# Altium project AuxPowerSupply.PrjPcb (part 1 of 3)
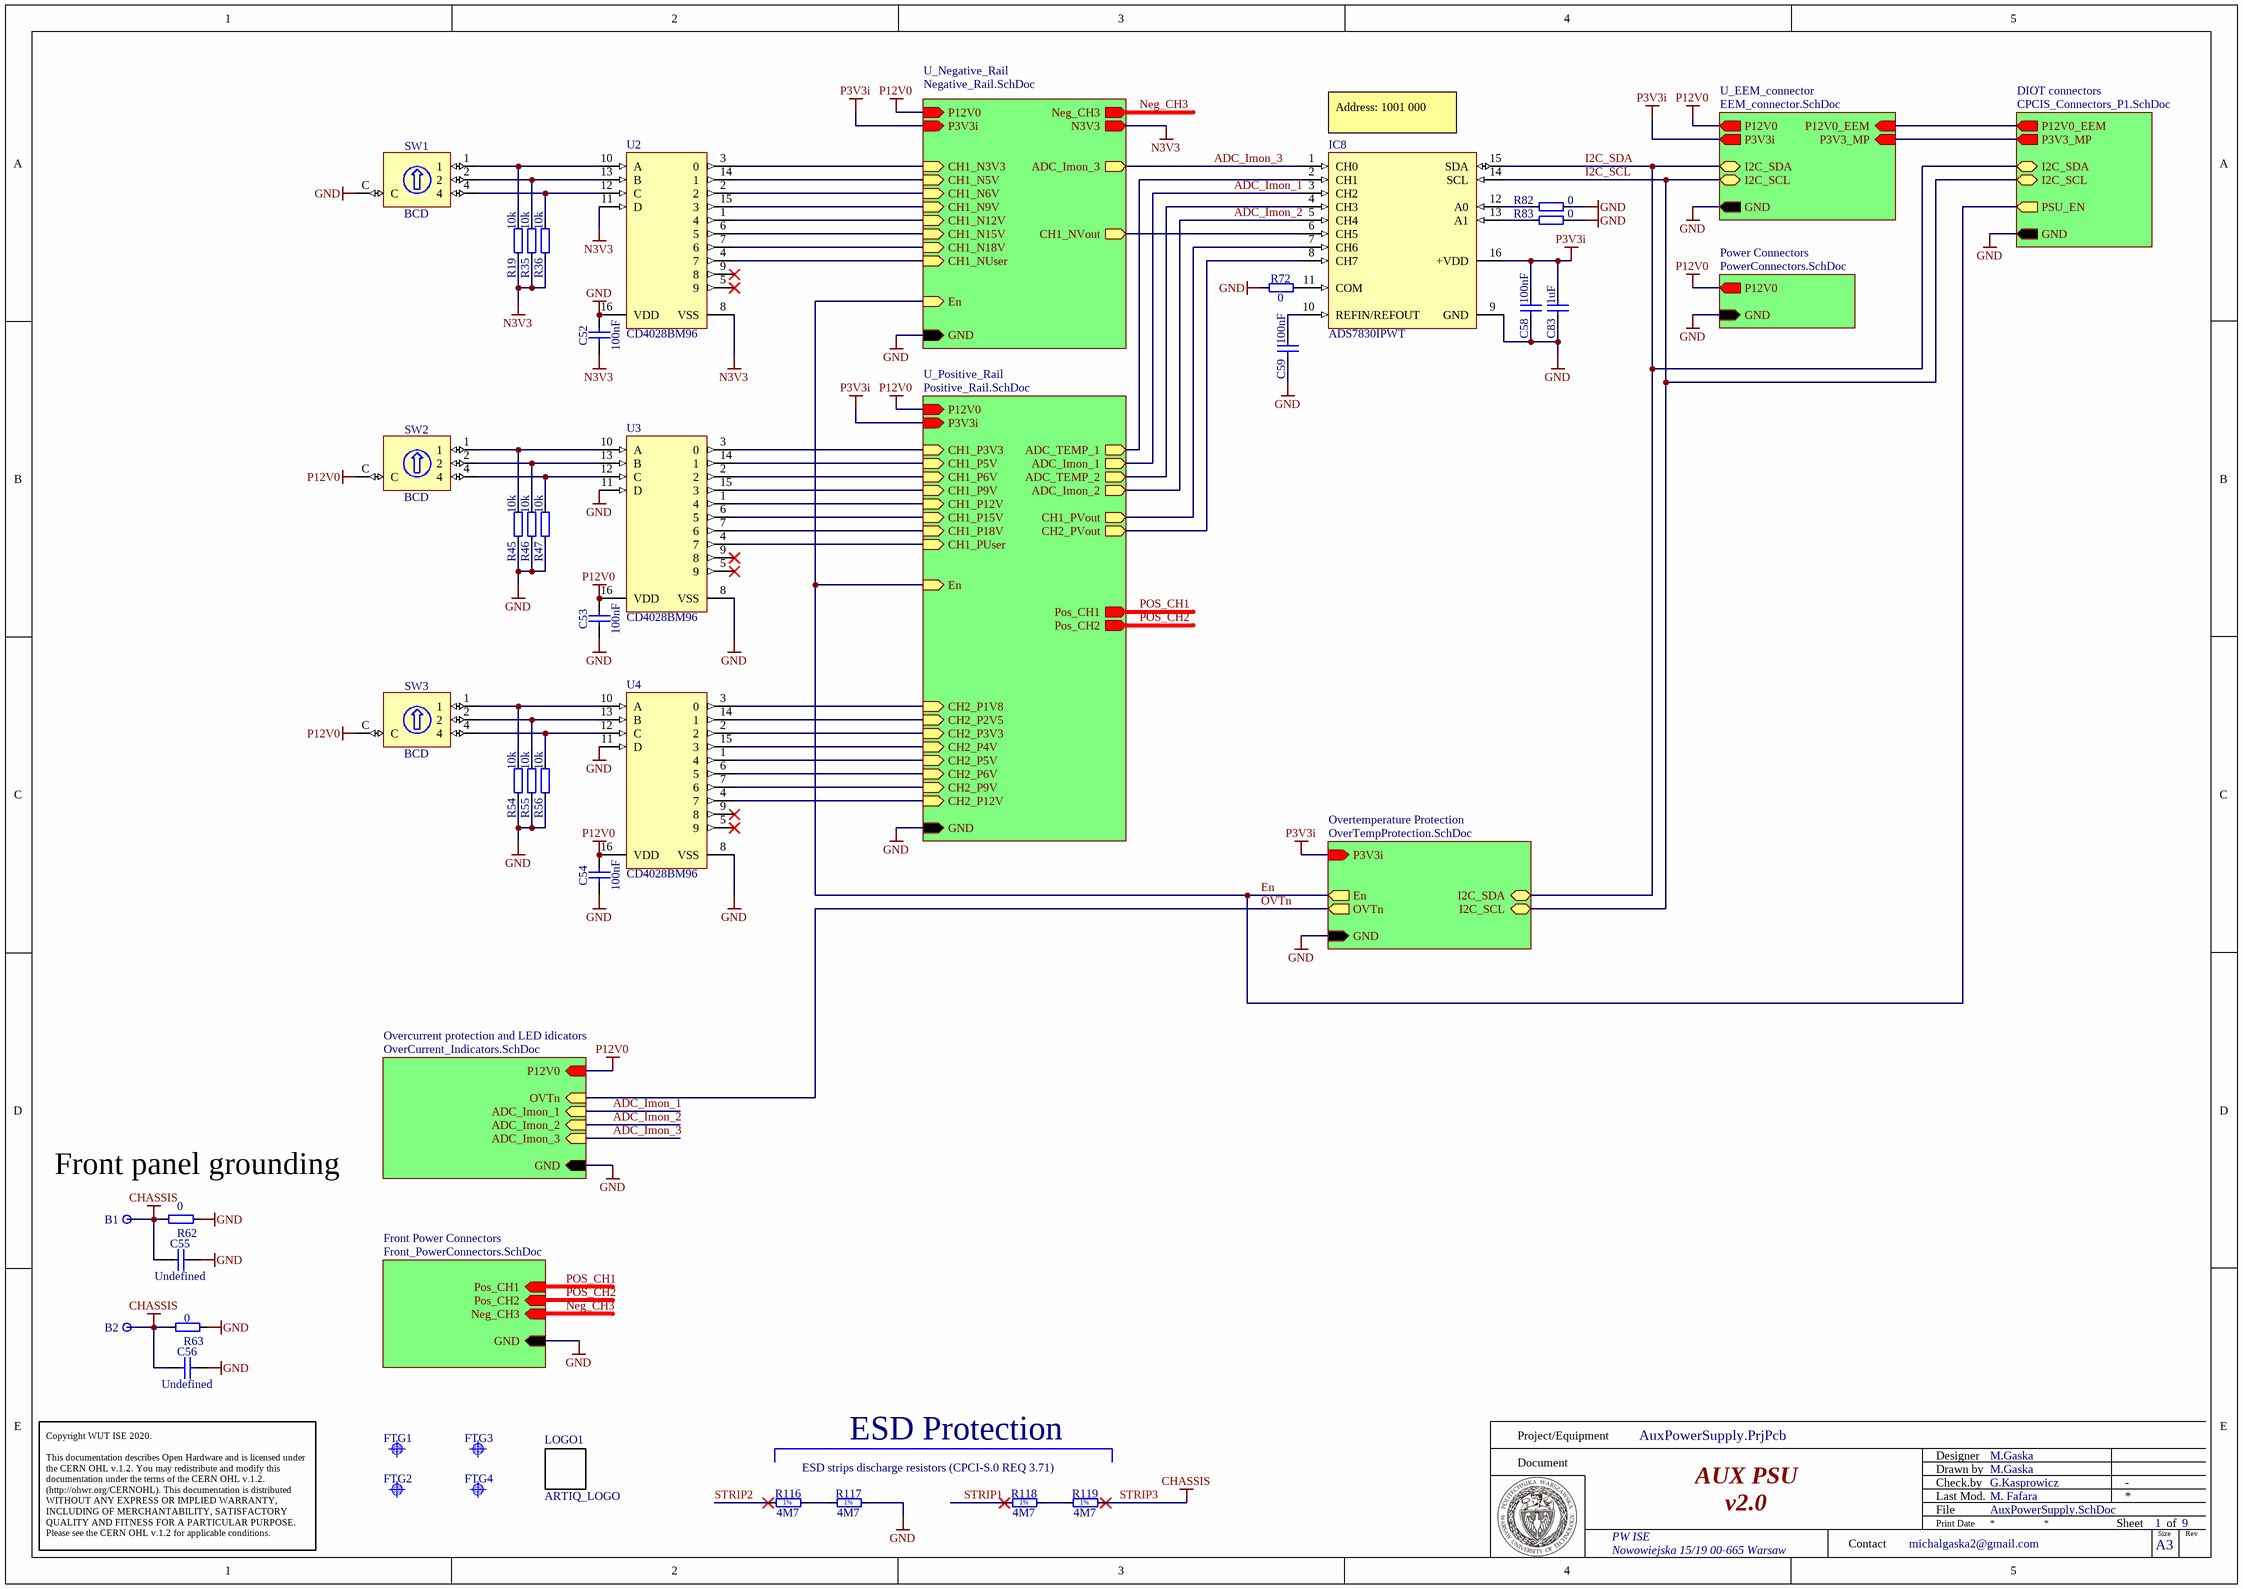
[diagram p0: AuxPowerSupply.SchDoc]
P_version: 2.0
9 sheets, 347 parts. Net scope: strictly hierarchical (ports join the sheet entries above them; power ports are local).
Board file: AuxPowerSupply.PcbDoc
Sheets:
  AuxPowerSupply.SchDoc
    U_Negative_Rail = Negative_Rail.SchDoc
    U_Positive_Rail = Positive_Rail.SchDoc
    U_EEM_connector = EEM_connector.SchDoc
    Power Connectors = PowerConnectors.SchDoc
    Overcurrent protection and LED idicators = OverCurrent_Indicators.SchDoc
    Front Power Connectors = Front_PowerConnectors.SchDoc
    Overtemperature Protection = OverTempProtection.SchDoc
    DIOT connectors = CPCIS_Connectors_P1.SchDoc

## Sheet AuxPowerSupply.SchDoc: AUX PSU
size 420 x 297 mm; CheckedBy: G.Kasprowicz; DrawnBy: M.Gaska; Address1: PW ISE; Address2: Nowowiejska 15/19 00-665 Warsaw; Address3: michalgaska2@gmail.com; DocumentNumber: 1; Revision: 2.0; SheetNumber: 1; SheetTotal: 9; EDA_Number: ARTIQ; Projet: AUX PSU; ModifiedBy: M. Fafara; CheckedDate: -; Title2: v2.0; DivGrp: WUT ISE; Designer: M.Gaska

### Parts
B1  (no value)  [MTG270_500]  (no BOM)
B2  (no value)  [MTG270_500]  (no BOM)
C52  100nF  [CAPC1608X87N]
C53  100nF  [CAPC1608X87N]
C54  100nF  [CAPC1608X87N]
C55  Undefined  [CAPC2012X135N]
C56  Undefined  [CAPC2012X135N]
C58  100nF  [CAPC1608X87N]
C59  100nF  [CAPC1608X87N]
C83  1uF  [CAPC1608X87N]
FTG1  (no value)  [FIDUCIAL_TOP_C100-200]
FTG2  (no value)  [FIDUCIAL_TOP_S100-200]
FTG3  (no value)  [FIDUCIAL_TOP_S100-200]
FTG4  (no value)  [FIDUCIAL_TOP_S100-200]
IC8  ADS7830IPWT  [SOP65P640X120-16N]
LOGO1  ARTIQ_LOGO  [ARTIQ_Logo]  (no BOM)
R19  10k  [RESC1608X55N]
R35  10k  [RESC1608X55N]
R36  10k  [RESC1608X55N]
R45  10k  [RESC1608X55N]
R46  10k  [RESC1608X55N]
R47  10k  [RESC1608X55N]
R54  10k  [RESC1608X55N]
R55  10k  [RESC1608X55N]
R56  10k  [RESC1608X55N]
R62  0  [RESC1608X55N]
R63  0  [RESC1608X55N]
R72  0  [RESC1608X55N]
R82  0  [RESC1608X55N]
R83  0  [RESC1608X55N]
R116  4M7  [RESC2113X55N]
R117  4M7  [RESC2113X55N]
R118  4M7  [RESC2113X55N]
R119  4M7  [RESC2113X55N]
SW1  BCD  [SW_NIDEC-COPAL-ELECTRONICS_S-81X1]
SW2  BCD  [SW_NIDEC-COPAL-ELECTRONICS_S-81X1]
SW3  BCD  [SW_NIDEC-COPAL-ELECTRONICS_S-81X1]
U2  CD4028BM96  [D0016A_M]
U3  CD4028BM96  [D0016A_M]
U4  CD4028BM96  [D0016A_M]

### Sub-sheets
DIOT connectors = CPCIS_Connectors_P1.SchDoc: I2C_SDA (bidir), I2C_SCL (bidir), GND (out), P12V0_EEM (out), P3V3_MP (out), PSU_EN (out)
Front Power Connectors = Front_PowerConnectors.SchDoc: Pos_CH1 (in), Pos_CH2 (in), Neg_CH3 (in), GND (in)
Overcurrent protection and LED idicators = OverCurrent_Indicators.SchDoc: P12V0 (in), GND (in), OVTn (in), ADC_Imon_3 (in), ADC_Imon_2 (in), ADC_Imon_1 (in)
Overtemperature Protection = OverTempProtection.SchDoc: P3V3i (in), GND (in), I2C_SDA (bidir), I2C_SCL (bidir), En (out), OVTn (out)
Power Connectors = PowerConnectors.SchDoc: GND (in), P12V0 (out)
U_EEM_connector = EEM_connector.SchDoc: I2C_SDA (bidir), I2C_SCL (bidir), P12V0 (out), P3V3i (out), GND (out), P12V0_EEM (in), P3V3_MP (in)
U_Negative_Rail = Negative_Rail.SchDoc: CH1_N18V (in), CH1_N5V (in), CH1_N9V (in), CH1_N12V (in), CH1_N15V (in), ADC_Imon_3 (out), CH1_NVout (out), CH1_N3V3 (in), CH1_NUser (in), CH1_N6V (in), En (in), GND (in), P12V0 (in), P3V3i (in), Neg_CH3 (out), N3V3 (out)
U_Positive_Rail = Positive_Rail.SchDoc: CH2_P6V (in), CH2_P3V3 (in), CH2_P4V (in), CH1_P15V (in), CH1_P9V (in), CH1_P12V (in), CH2_P5V (in), CH1_P5V (in), CH1_P18V (in), ADC_TEMP_2 (out), ADC_Imon_2 (out), ADC_Imon_1 (out), ADC_TEMP_1 (out), CH1_PVout (out), CH2_PVout (out), CH2_P2V5 (in), CH1_P3V3 (in), CH2_P1V8 (in), CH1_PUser (in), CH2_P9V (in), CH1_P6V (in), CH2_P12V (in), En (in), P12V0 (in), GND (in), Pos_CH1 (out), Pos_CH2 (out), P3V3i (in)

### Nets
GND: C52.2 C53.1 C54.1 C55.2 C56.2 C58.1 C59.1 C83.1 IC8.9(GND) R45.1 R46.1 R47.1 R54.1 R55.1 R56.1 R62.1 R63.1 R72.1 R82.2 R83.2 R117.2 SW1.C U2.16(VDD) U3.8(VSS) U3.11(D) U4.8(VSS) U4.11(D) ; sheet U_Negative_Rail/GND, sheet U_Positive_Rail/GND, sheet U_EEM_connector/GND, sheet Power Connectors/GND, sheet Overcurrent protection and LED idicators/GND, sheet Front Power Connectors/GND, sheet Overtemperature Protection/GND, sheet DIOT connectors/GND
N3V3: C52.1 R19.1 R35.1 R36.1 U2.8(VSS) U2.11(D) ; sheet U_Negative_Rail/N3V3
Neg_CH3: sheet U_Negative_Rail/Neg_CH3, sheet Front Power Connectors/Neg_CH3
P3V3_MP: sheet U_EEM_connector/P3V3_MP, sheet DIOT connectors/P3V3_MP
P3V3i: C58.2 C83.2 IC8.16(+VDD) ; sheet U_Negative_Rail/P3V3i, sheet U_Positive_Rail/P3V3i, sheet U_EEM_connector/P3V3i, sheet Overtemperature Protection/P3V3i
P12V0: C53.2 C54.2 SW2.C SW3.C U3.16(VDD) U4.16(VDD) ; sheet U_Negative_Rail/P12V0, sheet U_Positive_Rail/P12V0, sheet U_EEM_connector/P12V0, sheet Power Connectors/P12V0, sheet Overcurrent protection and LED idicators/P12V0
P12V0_EEM: sheet U_EEM_connector/P12V0_EEM, sheet DIOT connectors/P12V0_EEM
POS_CH1: sheet U_Positive_Rail/Pos_CH1, sheet Front Power Connectors/Pos_CH1
POS_CH2: sheet U_Positive_Rail/Pos_CH2, sheet Front Power Connectors/Pos_CH2
STRIP3: B1.1 B2.1 C55.1 C56.1 R62.2 R63.2 R119.2  [also labelled CHASSIS]
ADC_Imon_1: IC8.3(CH2) ; sheet U_Positive_Rail/ADC_Imon_1, sheet Overcurrent protection and LED idicators/ADC_Imon_1
ADC_Imon_2: IC8.5(CH4) ; sheet U_Positive_Rail/ADC_Imon_2, sheet Overcurrent protection and LED idicators/ADC_Imon_2
ADC_Imon_3: IC8.1(CH0) ; sheet U_Negative_Rail/ADC_Imon_3, sheet Overcurrent protection and LED idicators/ADC_Imon_3
CH1_NVout: IC8.6(CH5) ; sheet U_Negative_Rail/CH1_NVout
CH1_PVout: IC8.7(CH6) ; sheet U_Positive_Rail/CH1_PVout
CH2_PVout: IC8.8(CH7) ; sheet U_Positive_Rail/CH2_PVout
En: sheet U_Negative_Rail/En, sheet U_Positive_Rail/En, sheet Overtemperature Protection/En, sheet DIOT connectors/PSU_EN
I2C_SCL: IC8.14(SCL) ; sheet U_EEM_connector/I2C_SCL, sheet Overtemperature Protection/I2C_SCL, sheet DIOT connectors/I2C_SCL
I2C_SDA: IC8.15(SDA) ; sheet U_EEM_connector/I2C_SDA, sheet Overtemperature Protection/I2C_SDA, sheet DIOT connectors/I2C_SDA
OVTn: sheet Overcurrent protection and LED idicators/OVTn, sheet Overtemperature Protection/OVTn
STRIP1: R118.1
STRIP2: R116.1
NetC59_2: C59.2 IC8.10(REFIN/REFOUT)
NetC72_2: IC8.2(CH1) ; sheet U_Positive_Rail/ADC_TEMP_1
NetC75_2: IC8.4(CH3) ; sheet U_Positive_Rail/ADC_TEMP_2
NetIC8_11: IC8.11(COM) R72.2
NetIC8_12: IC8.12(A0) R82.1
NetIC8_13: IC8.13(A1) R83.1
NetIC12_1: U2.7(6) ; sheet U_Negative_Rail/CH1_N18V
NetIC12_3: U2.6(5) ; sheet U_Negative_Rail/CH1_N15V
NetIC12_5: U2.4(7) ; sheet U_Negative_Rail/CH1_NUser
NetIC12_9: U2.1(4) ; sheet U_Negative_Rail/CH1_N12V
NetIC12_11: U2.2 ; sheet U_Negative_Rail/CH1_N6V
NetIC12_13: U2.15(3) ; sheet U_Negative_Rail/CH1_N9V
NetIC13_1: U2.14(1) ; sheet U_Negative_Rail/CH1_N5V
NetIC13_3: U2.3(0) ; sheet U_Negative_Rail/CH1_N3V3
NetR19_2: R19.2 SW1.1 U2.10(A)
NetR35_2: R35.2 SW1.2 U2.13(B)
NetR36_2: R36.2 SW1.4 U2.12(C)
NetR45_2: R45.2 SW2.1 U3.10(A)
NetR46_2: R46.2 SW2.2 U3.13(B)
NetR47_2: R47.2 SW2.4 U3.12(C)
NetR54_2: R54.2 SW3.1 U4.10(A)
NetR55_2: R55.2 SW3.2 U4.13(B)
NetR56_2: R56.2 SW3.4 U4.12(C)
NetR116_2: R116.2 R117.1
NetR118_2: R118.2 R119.1
NetT1_1: U3.7(6) ; sheet U_Positive_Rail/CH1_P18V
NetT2_1: U3.6(5) ; sheet U_Positive_Rail/CH1_P15V
NetT3_1: U3.1(4) ; sheet U_Positive_Rail/CH1_P12V
NetT4_1: U3.15(3) ; sheet U_Positive_Rail/CH1_P9V
NetT5_1: U3.14(1) ; sheet U_Positive_Rail/CH1_P5V
NetT6_1: U4.6(5) ; sheet U_Positive_Rail/CH2_P6V
NetT7_1: U4.1(4) ; sheet U_Positive_Rail/CH2_P5V
NetT8_1: U4.15(3) ; sheet U_Positive_Rail/CH2_P4V
NetT9_1: U4.2 ; sheet U_Positive_Rail/CH2_P3V3
NetT21_1: U3.2 ; sheet U_Positive_Rail/CH1_P6V
NetT22_1: U3.3(0) ; sheet U_Positive_Rail/CH1_P3V3
NetT23_1: U3.4(7) ; sheet U_Positive_Rail/CH1_PUser
NetT24_1: U4.14(1) ; sheet U_Positive_Rail/CH2_P2V5
NetT25_1: U4.3(0) ; sheet U_Positive_Rail/CH2_P1V8
NetT26_1: U4.4(7) ; sheet U_Positive_Rail/CH2_P12V
NetT27_1: U4.7(6) ; sheet U_Positive_Rail/CH2_P9V

Not connected (* = marked no-connect by the designer): U2 5(9)* 9(8)*; U3 5(9)* 9(8)*; U4 5(9)* 9(8)*

### Notes on the sheet
- (near IC8) Address: 1001 000
- Front panel grounding
- ESD strips discharge resistors (CPCI-S.0 REQ 3.71)
- ESD Protection
- Project/Equipment
- Document
- Designer
- Drawn by
- Check.by
- Copyright WUT ISE 2020.
  This documentation describes Open Hardware and is licensed under the CERN OHL v.1.2. You may redistribute and modify this documentation under the terms of the CERN OHL v.1.2. (http://ohwr.org/CERNOHL). This documentation is distributed WITHOUT ANY EXPRESS OR IMPLIED WARRANTY, INCLUDING OF MERCHANTABILITY, SATISFACTORY QUALITY AND FITNESS FOR A PARTICULAR PURPOSE. Please see the CERN OHL v.1.2 for applicable conditions.
- Contact
- File
- Last Mod.
- Print Date
- Sheet
- Size
- A3
- of
- Rev
- (in symbol R0805_4M7_1%_0.125W_100PPM_VISHAY_CRCW e3) 1%

### Library data of the parts
B1 B2 = PLATED_HOLE2.7_PAD5.0: Single Terminal Socket; Part Description: Plated Through Hole: Hole Dia.=2.7mm Pad Dia.=5.0mm; Mounted: No; Part Number: PLATED_HOLE2.7_PAD5.0; Component Type: Standard (No BOM); Pin Count: 1; Family: Plated Hole; Socket: No; SMD: No; Sense: No; Status: None; ComponentHeight: 0mm; HelpURL: Undefined; Author: CERN DEM JMW; CreateDate: 27.09.2011; LatestRevisionDate: 27.09.2011; PackageDescription: Plated Through Hole: Hole Dia.=2.7mm Pad Dia.=5.0mm
C52-C54 C58 C59 = CC0603_100NF_50V_10%_X5R: Non-polarised capacitor; Part Description: SMD Multilayer Chip Ceramic Capacitor; Manufacturer: GENERIC; Manufacturer1 Part Number: C1608X5R1H104K080; Voltage: 50V; TC: X5R; Tolerance: ±10%; Part Number: CC0603_100NF_50V_10%_X5R; Component Kind: Standard; Component Type: Standard; Pin Count: 2; Value: 100nF; Status: None; Manufacturer Part Number: CC0603_100NF_50V_10%_X5R; Case: 0603; Mounted: Yes; Socket: No; SMD: Yes; Sense: No; Manufacturer1 Example: TDK; Manufacturer1 ComponentHeight: 0.9mm; HelpURL: \\cern.ch\dfs\Applications\Altium\Datasheets\CC0603_X5R_TDK_C.pdf; Author: CERN DEM MR; CreateDate: 08.01.2016; LatestRevisionDate: 08.01.2016
C55 C56 = CC0805_NO-VALUE: Non-polarised capacitor; Part Description: Reserved Footprint For 0805(2012) Chip Ceramic Capacitor; Mounted: No; Part Number: CC0805_NO-VALUE; Component Kind: Standard; Component Type: Standard; Pin Count: 2; Value: Undefined; Status: None; Manufacturer: Undefined; Manufacturer Part Number: CC0805_NO-VALUE; Case: 0805; Socket: No; SMD: Yes; Sense: No; Manufacturer1 ComponentHeight: 1.35mm; HelpURL: Undefined; Author: CERN DEM JLC; CreateDate: 10.12.2008; LatestRevisionDate: 11.09.2013
C83 = CC0603_1UF_25V_10%_X7R: Non-polarised capacitor; Part Description: SMD Multilayer Chip Ceramic Capacitor; Manufacturer: GENERIC; Manufacturer1 Part Number: GRM188R71E105KA12D; Voltage: 25V; TC: X7R; Tolerance: ±10%; Part Number: CC0603_1UF_25V_10%_X7R; Component Kind: Standard; Component Type: Standard; Pin Count: 2; Value: 1uF; Status: None; Manufacturer Part Number: CC0603_1UF_25V_10%_X7R; Case: 0603; Mounted: Yes; Socket: No; SMD: Yes; Sense: No; Manufacturer1 Example: MURATA; Manufacturer1 ComponentHeight: 0.9mm; HelpURL: \\cern.ch\dfs\Applications\Altium\Datasheets\CC0603_X7R_MURATA.pdf; Author: CERN DEM JLC; CreateDate: 18.01.2011; LatestRevisionDate: 18.01.2011
FTG1 = FIDUCIAL_TARGET_C100-200: Fiducial Target; Part Description: Round Fiducial Target, Top Layer, 1.0mm, Top Solder 2.0mm, Keepout =2.0mm; Mounted: No; Part Number: FIDUCIAL_TARGET_C100-200; Component Kind: Standard (No BOM); Component Type: Standard (No BOM); Pin Count: 1; Family: Fiducial; Socket: No; SMD: Yes; Sense: No; Status: None; ComponentHeight: 0mm; HelpURL: Undefined; Author: CERN DEM JLC; CreateDate: 09.02.2010; LatestRevisionDate: 04.04.2012; PackageDescription: Round Fiducial Target, Top Layer, 1.0mm, Top Solder 2.0mm, Keepout =2.0mm
FTG2-FTG4 = FIDUCIAL_TARGET_S100-200: Fiducial Target; Part Description: Square Fiducial Target, Top Layer, 1.0mm, Top Solder 2.0mm, Keepout =2.0mm; Mounted: No; Part Number: FIDUCIAL_TARGET_S100-200; Component Kind: Standard (No BOM); Component Type: Standard (No BOM); Pin Count: 1; Family: Fiducial; Socket: No; SMD: Yes; Sense: No; Status: None; ComponentHeight: 0mm; HelpURL: Undefined; Author: CERN DEM JLC; CreateDate: 09.02.2010; LatestRevisionDate: 04.04.2012; PackageDescription: Square Fiducial Target, Top Layer, 1.0mm, Top Solder 2.0mm, Keepout =2.0mm
IC8 = ADS7830IPWT: 8-Bit, 8-Channel Sampling A/D Converter with I2C Interface 16-TSSOP -40 to 85; MF: Texas Instruments; Package: TSSOP-16 Texas Instruments; Availability: Unavailable; Value: *; MP: ADS7830IPWT; Price: None; Manufacturer Part Number: ADS7830IPWT
LOGO1 = CMP-00028-00007-2: ARTIQ logo to place on the PCB
R19 R35 R36 R45-R47 R54-R56 = R0603_10K_1%_0.1W_100PPM: Resistor - 1%; Part Description: General Purpose Thick Film Chip Resistor; Manufacturer: GENERIC; Manufacturer1 Part Number: NRC06F1002TRF; Power: 0.1W; TC: ±100ppm/°C; PressFit: No; Part Number: R0603_10K_1%_0.1W_100PPM; Component Kind: Standard; Component Type: Standard; Pin Count: 2; Value: 10k; Status: Preferred; Tolerance: ±1%; Manufacturer Part Number: R0603_10K_1%_0.1W_100PPM; Case: 0603; Mounted: Yes; Sense: No; Socket: No; SMD: Yes; Manufacturer1 Example: NIC COMPONENT; Manufacturer1 ComponentHeight: 0.55mm; HelpURL: \\cern.ch\dfs\Applications\Altium\Datasheets\R0603_NIC_NRC.pdf; Author: CERN DEM JLC; CreateDate: 03.12.2007; LatestRevisionDate: 13.03.2008
R62 R63 R72 R82 R83 = R0603_0R_JUMPER: Resistor; Part Description: 1A (0.05R Max DC Resistance) Zero Ohm Jumper; Manufacturer: GENERIC; Manufacturer1 Part Number: NRC06Z0; PressFit: No; Part Number: R0603_0R_JUMPER; Component Kind: Standard; Component Type: Standard; Pin Count: 2; Value: 0; Status: Preferred; Manufacturer Part Number: R0603_0R_JUMPER; Case: 0603; Mounted: Yes; Sense: No; Socket: No; SMD: Yes; Manufacturer1 Example: NIC COMPONENT; Manufacturer1 ComponentHeight: 0.55mm; HelpURL: \\cern.ch\dfs\Applications\Altium\Datasheets\R0603_NIC_NRC.pdf; Author: CERN DEM JLC; CreateDate: 03.12.2007; LatestRevisionDate: 13.03.2008
R116-R119 = R0805_4M7_1%_0.125W_100PPM_VISHAY_CRCW e3: Resistor - 1%; Part Description: 150V, Standard Thick Film Chip Resistor; Manufacturer: VISHAY; Manufacturer Part Number: CRCW08054M70FKEA; Power: 0.125W; TC: ±100ppm/°C; PressFit: No; Part Number: R0805_4M7_1%_0.125W_100PPM_VISHAY_CRCW e3; Component Kind: Standard; Component Type: Standard; Pin Count: 2; Value: 4M7; Status: None; Tolerance: ±1%; Case: 0805; Mounted: Yes; Sense: No; Socket: No; SMD: Yes; ComponentHeight: 0.5mm; HelpURL: \\cern.ch\dfs\Applications\Altium\Datasheets\R0805_VISHAY_CRCW e3.pdf; Author: CERN DEM BR; CreateDate: 27.05.2019; LatestRevisionDate: 27.05.2019
SW1-SW3 = SW_Rotary_S-8111: Rotary Code Switch 1 2 4 C; Part Number: SW_NIDEC-COPAL-ELECTRONICS_S-8111; Part Description: Body 7.2x7.2mm, Right Angled Rotary Real Code 8 Positions Switch, NIDEC-COPAL-ELECTRONICS (S-8000) Series; Manufacturer: NIDEC-COPAL-ELECTRONICS; Manufacturer Part Number: S-8111; PressFit: No; Component Kind: Standard; Component Type: Standard; Pin Count: 4; PackageDescription: Body 7.2x7.2mm, Right Angled Rotary 8 Positions Switch, NIDEC-COPAL-ELECTRONICS (S-8000) Series; Family: BCD; Mounted: Yes; Socket: No; SMD: No; Sense: No; Status: None; ComponentHeight: 7.2mm; HelpURL: \\cern.ch\dfs\Applications\Altium\Datasheets\SW_NIDEC-COPAL-ELECTRONICS_S-8000.pdf; Author: CERN DEM BC; CreateDate: 06.11.2020; LatestRevisionDate: 06.11.2020
U2-U4 = CMP-015-00008-1: Decimal Decoder/Driver, 4000/14000/40000 Series, True Output, CMOS, PDSO16; Min Supply Voltage: 3V; Max Supply Voltage: 18V; Min Operating Temperature: -55°C; Case/Package: SOP; Pins: 16; Max Operating Temperature: 125°C; RoHS Compliant: Yes

## Sheet Negative_Rail.SchDoc: Negative Rail
size 420 x 297 mm; CheckedBy: G.Kasprowicz; DrawnBy: M.Gaska; Address1: PW ISE; Address2: Nowowiejska 15/19 00-665 Warsaw; Address3: michalgaska2@gmail.com; DocumentNumber: 2; Revision: 2.0; SheetNumber: 5; SheetTotal: 9; EDA_Number: ARTIQ; Projet: AUX PSU; ModifiedBy: M. Fafara; CheckedDate: -; Title2: v2.0; DivGrp: WUT ISE; Designer: M.Gaska
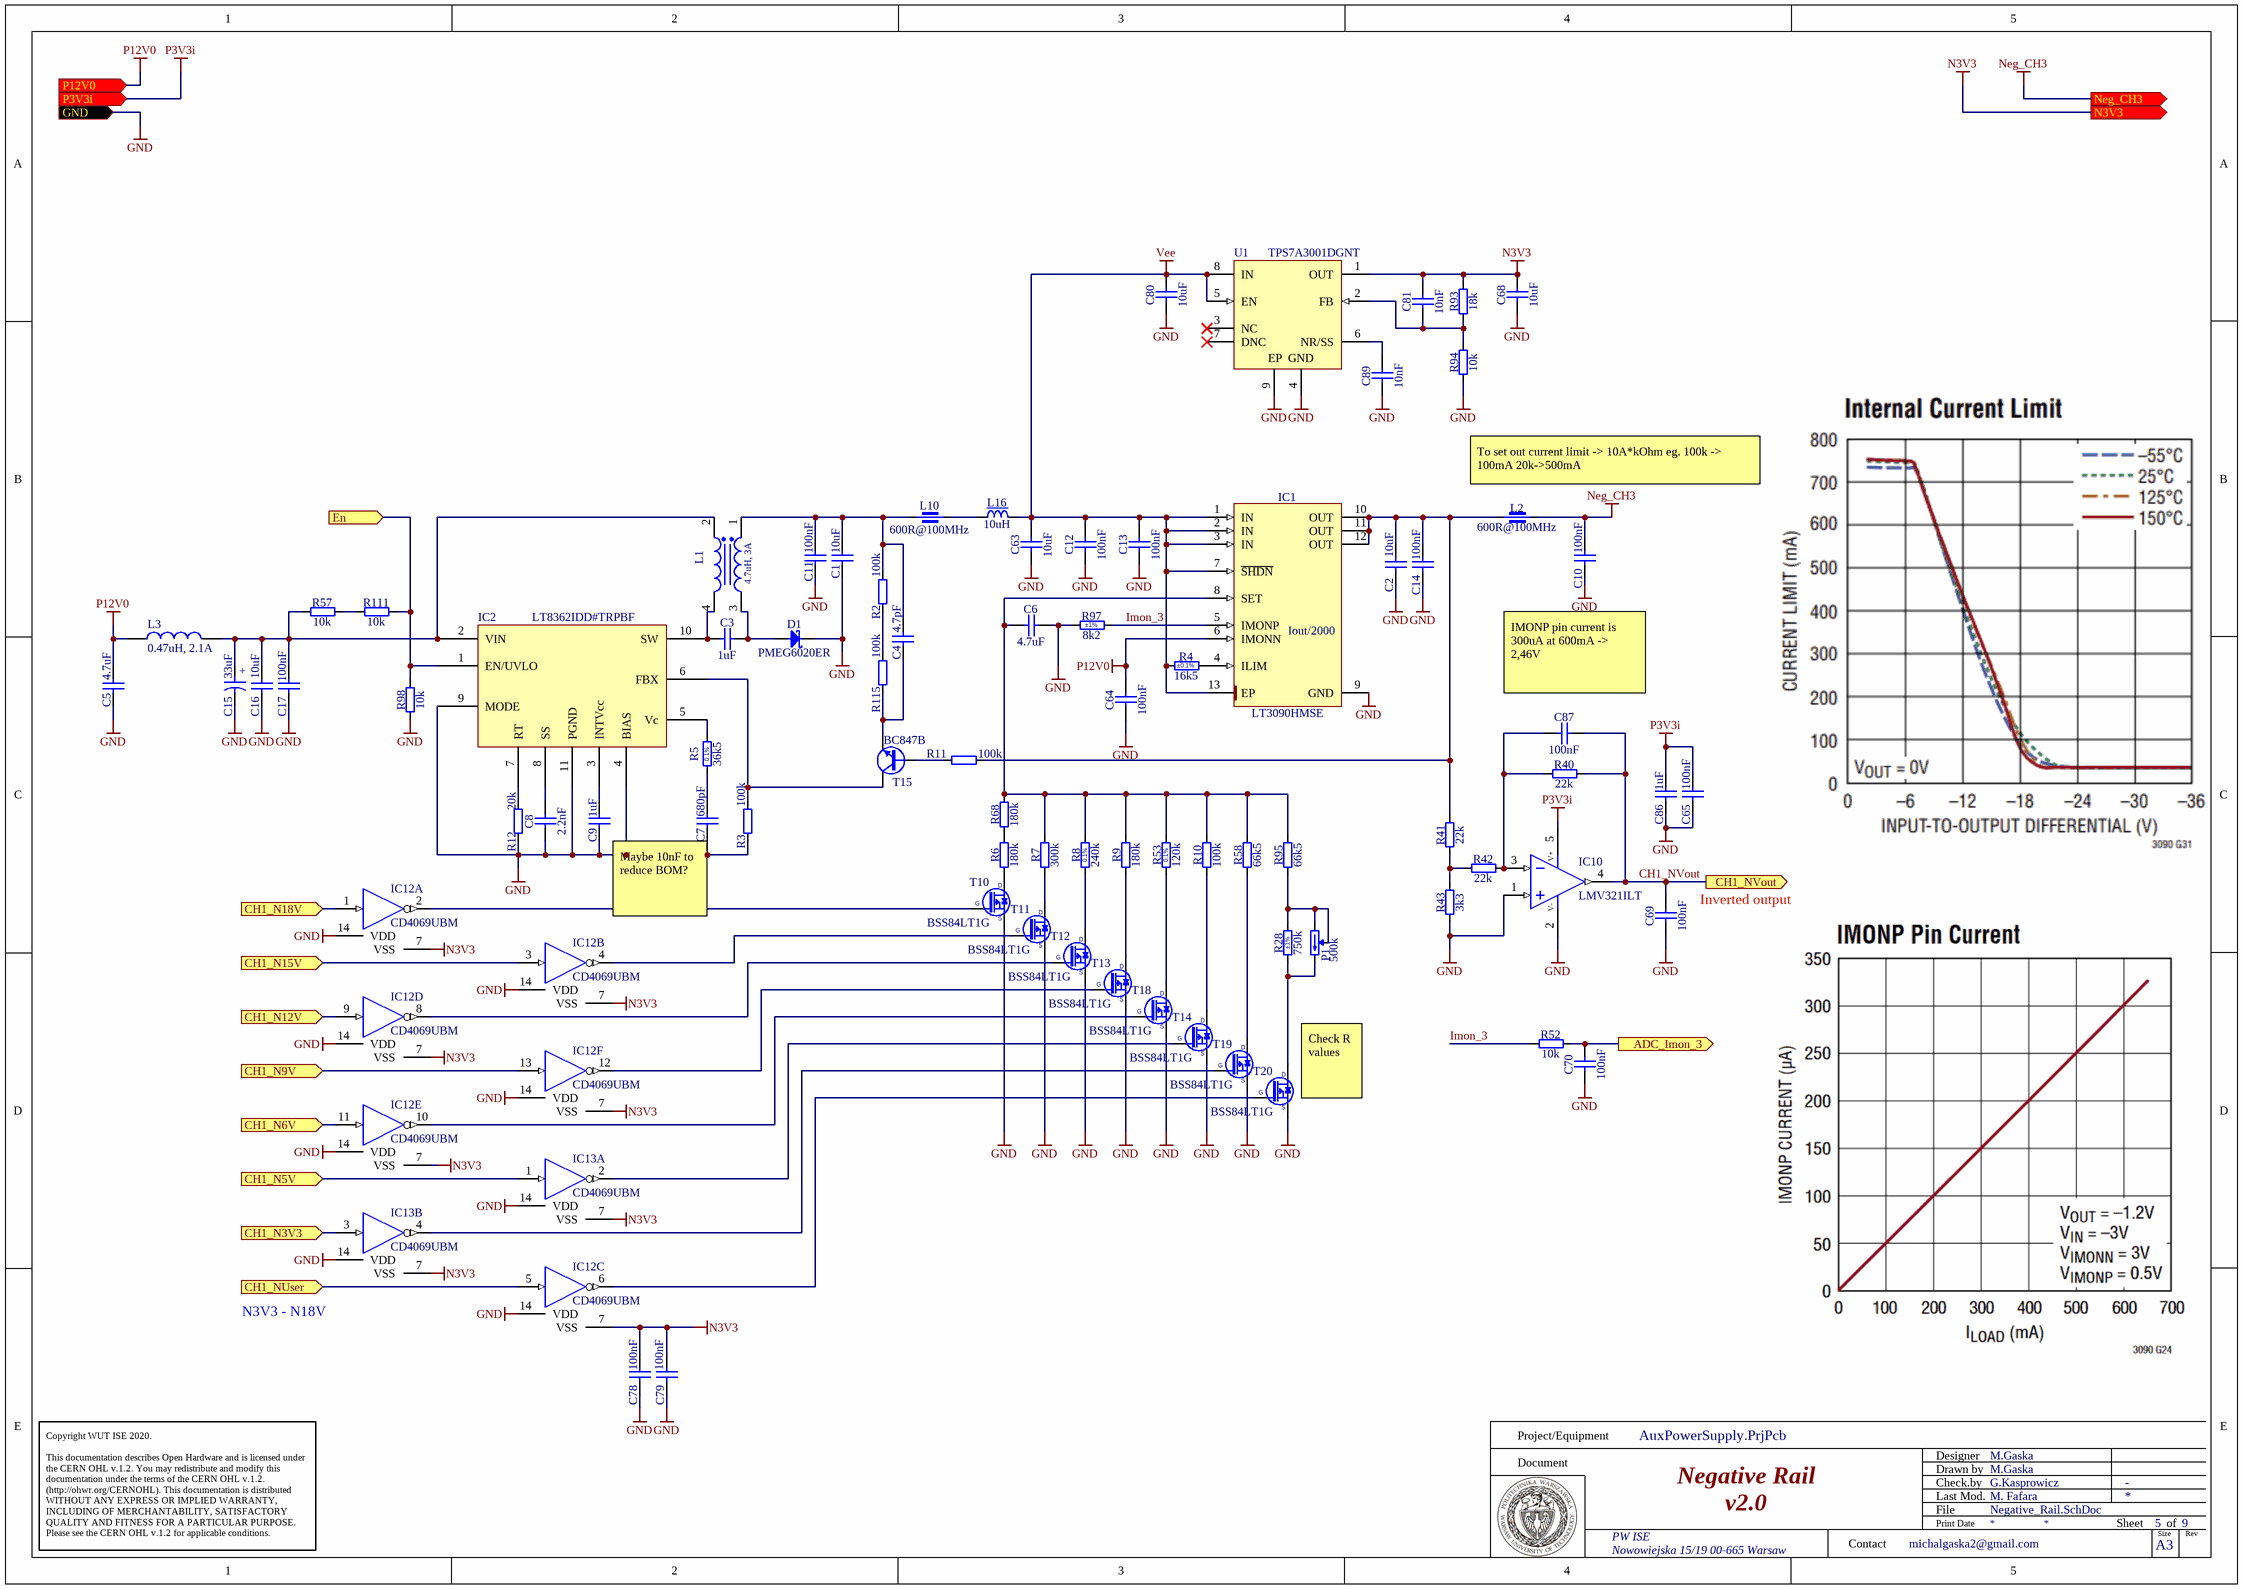
[diagram p1: Negative_Rail.SchDoc]

### Parts
C1  10uF  [CAPC3216X190N]
C2  10uF  [CAPC3216X190N]
C3  1uF  [CAPC3216X140N]
C4  4.7pF  [CAPC1608X87N]
C5  4.7uF  [CAPC1608X90N]
C6  4.7uF  [CAPC1608X90N]
C7  680pF  [CAPC1608X87N]
C8  2.2nF  [CAPC1005X55N]
C9  1uF  [CAPC1608X87N]
C10  100nF  [CAPC1608X87N]
C11  100nF  [CAPC1608X87N]
C12  100nF  [CAPC1608X87N]
C13  100nF  [CAPC1608X87N]
C14  100nF  [CAPC1608X87N]
C15  33uF  [CAPAE660X540N]
C16  10uF  [CAPC3216X190N]
C17  100nF  [CAPC1608X87N]
C63  10uF  [CAPC3216X190N]
C64  100nF  [CAPC1608X87N]
C65  100nF  [CAPC1608X87N]
C68  10uF  [CAPC3216X190N]
C69  100nF  [CAPC1608X87N]
C70  100nF  [CAPC1608X87N]
C78  100nF  [CAPC1608X87N]
C79  100nF  [CAPC1608X87N]
C80  10uF  [CAPC3216X190N]
C81  10nF  [CAPC1608X87N]
C86  1uF  [CAPC1608X87N]
C87  100nF  [CAPC1608X87N]
C89  10nF  [CAPC1608X87N]
D1  PMEG6020ER  [SODFL3517X110N]
IC1  LT3090HMSE  [SOP65P490X110-13N-R175X294]
IC2  LT8362IDD#TRPBF  [SON50P300X300X80-11N-R160X240]
IC10  LMV321ILT  [SOT95P280X145-5N]
IC12  CD4069UBM  [SOIC127P600X175-14N]  (parts A,B,C,D,E,F of 6)
IC13  CD4069UBM  [SOIC127P600X175-14N]  (parts A,B of 6)
L1  4.7uH, 3A  [WE-DD_1260]
L2  600R@100MHz  [INDC2012X110N]
L3  0.47uH, 2.1A  [WE-PMI_0806_H1]
L10  600R@100MHz  [INDC2012X110N]
L16  10uH  [IND_BOURNS_PM43]
P1  value 500k  [Bourns_3059Y]  (hidden comment: 3059Y-1-504LF)
R2  100k  [RESC1608X55N]
R3  100k  [RESC1608X55N]
R4  16k5  Tolerance: ±0.1%  [RESC1608X55N]
R5  36k5  [RESC1608X55N]
R6  180k  [RESC2012X60N]
R7  300k  [RESC2012X60N]
R8  240k  [RESC2012X60N]
R9  180k  [RESC2012X60N]
R10  100k  [RESC2012X60N]
R11  100k  [RESC1608X55N]
R12  20k  [RESC1608X55N]
R28  750k  Tolerance: ±1%  [RESC2012X60N]
R40  22k  [RESC1608X55N]
R41  22k  [RESC1608X55N]
R42  22k  [RESC1608X55N]
R43  3k3  [RESC1608X55N]
R52  10k  [RESC1608X55N]
R53  120k  [RESC2012X60N]
R57  10k  [RESC1608X55N]
R58  66k5  [RESC2012X60N]
R68  180k  [RESC2012X60N]
R93  18k  [RESC1608X55N]
R94  10k  [RESC1608X55N]
R95  66k5  [RESC2012X60N]
R97  8k2  Tolerance: ±1%  [RESC1608X55N]
R98  10k  [RESC1608X55N]
R111  10k  [RESC1608X55N]
R115  100k  [RESC1608X55N]
T10  BSS84LT1G  [SOT95P240X110-3N]
T11  BSS84LT1G  [SOT95P240X110-3N]
T12  BSS84LT1G  [SOT95P240X110-3N]
T13  BSS84LT1G  [SOT95P240X110-3N]
T14  BSS84LT1G  [SOT95P240X110-3N]
T15  BC847B  [SOT95P230X110-3N]
T18  BSS84LT1G  [SOT95P240X110-3N]
T19  BSS84LT1G  [SOT95P240X110-3N]
T20  BSS84LT1G  [SOT95P240X110-3N]
U1  TPS7A3001DGNT  [TI-DGN8-1760X1425TP_M]

### Ports
ADC_Imon_3 (out), CH1_N3V3 (in), CH1_N5V (in), CH1_N6V (in), CH1_N9V (in), CH1_N12V (in), CH1_N15V (in), CH1_N18V (in), CH1_NUser (in), CH1_NVout (out), En (in), GND (in), N3V3 (out), Neg_CH3 (out), P3V3i (in), P12V0 (in)

### Nets
GND: C1.1 C2.1 C5.1 C6.2 C7.1 C8.1 C9.1 C10.1 C11.1 C12.1 C13.1 C14.1 C15.2 C16.1 C17.1 C63.1 C64.1 C65.1 C68.1 C69.1 C70.1 C78.1 C79.1 C80.1 C86.1 C89.1 D1.1(C) IC1.9(GND) IC2.4(BIAS) IC2.9(MODE) IC2.11(PGND) IC10.1(IN+) IC10.2(V-) IC12.14(VDD) IC13.14(VDD) R3.1 R12.1 R43.1 R94.1 R97.1 R98.1 T10.2(S) T11.2(S) T12.2(S) T13.2(S) T14.2(S) T18.2(S) T19.2(S) T20.2(S) U1.4(GND) U1.9(EP) ; port GND
N3V3: C68.2 C78.2 C79.2 C81.2 IC12.7(VSS) IC13.7(VSS) R93.2 U1.1(OUT) ; port N3V3
Neg_CH3: C10.2 L2.2 ; port Neg_CH3
P3V3i: C65.2 C86.2 IC10.5(V+) ; port P3V3i
P12V0: C5.2 C64.2 IC1.6(IMONN) L3.1 ; port P12V0
Vee: C12.2 C13.2 C63.2 C80.2 IC1.1(IN) IC1.2(IN) IC1.3(IN) IC1.7(~{SHDN}) IC1.13(EP) L16.2 R4.1 U1.5(EN) U1.8(IN)
ADC_Imon_3: C70.2 R52.2 ; port ADC_Imon_3
CH1_NVout: C69.2 C87.2 IC10.4(OUT) R40.2 ; port CH1_NVout
En: IC2.1(EN/UVLO) R98.2 R111.2 ; port En
Imon_3: IC1.5(IMONP) R52.1 R97.2
NetC1_2: C1.2 C4.2 C11.2 L1.1 L10.1 R2.2
NetC2_2: C2.2 C14.2 IC1.10(OUT) IC1.11(OUT) IC1.12(OUT) L2.1 R11.1 R41.2
NetC3_1: C3.1 IC2.10(SW) L1.4
NetC3_2: C3.2 D1.2(A) L1.3
NetC4_1: C4.1 R115.1 T15.2(E)
NetC6_1: C6.1 IC1.8(SET) R7.2 R8.2 R9.2 R10.2 R53.2 R58.2 R68.2 R95.2
NetC7_2: C7.2 R5.1
NetC8_2: C8.2 IC2.8(SS)
NetC9_2: C9.2 IC2.3(INTVcc)
NetC15_1: C15.1 C16.2 C17.2 IC2.2(VIN) L1.2 L3.2 R57.1
NetC81_1: C81.1 R93.1 R94.2 U1.2(FB)
NetC87_1: C87.1 IC10.3(IN-) R40.1 R42.2
NetC89_2: C89.2 U1.6(NR/SS)
NetIC1_4: IC1.4(ILIM) R4.2
NetIC2_5: IC2.5(Vc) R5.2
NetIC2_6: IC2.6(FBX) R3.2 T15.3(C)
NetIC2_7: IC2.7(RT) R12.2
NetIC12_1: IC12.1(IN) ; port CH1_N18V
NetIC12_2: IC12.2(OUT) T10.1(G)
NetIC12_3: IC12.3(IN) ; port CH1_N15V
NetIC12_4: IC12.4(OUT) T11.1(G)
NetIC12_5: IC12.5(IN) ; port CH1_NUser
NetIC12_6: IC12.6(OUT) T20.1(G)
NetIC12_8: IC12.8(OUT) T12.1(G)
NetIC12_9: IC12.9(IN) ; port CH1_N12V
NetIC12_10: IC12.10(OUT) T18.1(G)
NetIC12_11: IC12.11(IN) ; port CH1_N6V
NetIC12_12: IC12.12(OUT) T13.1(G)
NetIC12_13: IC12.13(IN) ; port CH1_N9V
NetIC13_1: IC13.1(IN) ; port CH1_N5V
NetIC13_2: IC13.2(OUT) T14.1(G)
NetIC13_3: IC13.3(IN) ; port CH1_N3V3
NetIC13_4: IC13.4(OUT) T19.1(G)
NetL10_2: L10.2 L16.1
NetP1_1: P1.1(CCW) P1.2(W) R28.2 R95.1
NetP1_3: P1.3(CW) R28.1 T20.3(D)
NetR2_1: R2.1 R115.2
NetR6_1: R6.1 T10.3(D)
NetR6_2: R6.2 R68.1
NetR7_1: R7.1 T11.3(D)
NetR8_1: R8.1 T12.3(D)
NetR9_1: R9.1 T13.3(D)
NetR10_1: R10.1 T14.3(D)
NetR11_2: R11.2 T15.1(B)
NetR41_1: R41.1 R42.1 R43.2
NetR53_1: R53.1 T18.3(D)
NetR57_2: R57.2 R111.1
NetR58_1: R58.1 T19.3(D)

Not connected (* = marked no-connect by the designer): U1 3(NC)* 7(DNC)*

### Notes on the sheet
- (near L2) To set out current limit -> 10A*kOhm eg. 100k -> 100mA 20k->500mA
- (near IC1) Iout/2000
- IMONP pin current is 300uA at 600mA -> 2,46V
- Maybe 10nF to reduce BOM?
- (near C69) Inverted output
- (near T20) Check R values
- (near IC13) N3V3 - N18V
- Project/Equipment
- Document
- Designer
- Drawn by
- Check.by
- Copyright WUT ISE 2020.
  This documentation describes Open Hardware and is licensed under the CERN OHL v.1.2. You may redistribute and modify this documentation under the terms of the CERN OHL v.1.2. (http://ohwr.org/CERNOHL). This documentation is distributed WITHOUT ANY EXPRESS OR IMPLIED WARRANTY, INCLUDING OF MERCHANTABILITY, SATISFACTORY QUALITY AND FITNESS FOR A PARTICULAR PURPOSE. Please see the CERN OHL v.1.2 for applicable conditions.
- Contact
- File
- Last Mod.
- Print Date
- Sheet
- Size
- A3
- of
- Rev
- (in symbol CAE660-540_33UF_35V_20%) +
- (in symbol R0603_36K5_0.1%_0.063W_10PPM) 0.1%
- (in symbol R0805_120K_0.1%_0.125W_25PPM) 0.1%
- (in symbol R0805_240K_0.1%_0.1W_10PPM) 0.1%

### Library data of the parts
C1 C2 C16 C63 C68 C80 = CC1206_10UF_35V_10%_X7R_YUDEN_GMJ316BB7106KLHT: Non-polarised capacitor; Part Description: Soft Termination SMD Multilayer Chip Ceramic Capacitor for Automotive / Industrial Applications; Manufacturer: TAIYO YUDEN; Voltage: 35V; TC: X7R; Tolerance: ±10%; Status Comment: for Not Designs; Part Number: CC1206_10UF_35V_10%_X7R_YUDEN_GMJ316BB7106KLHT; Component Kind: Standard; Component Type: Standard; Pin Count: 2; Value: 10uF; Status: Not Recommended; Manufacturer Part Number: GMJ316BB7106KLHT; Case: 1206; Mounted: Yes; Socket: No; SMD: Yes; Sense: No; ComponentHeight: 1.90mm; HelpURL: \\cern.ch\dfs\Applications\Altium\Datasheets\CC1206_TAIYO-YUDEN_GMJ316BB7106KLHT.pdf; Author: CERN DEM BC; CreateDate: 26.02.2016; LatestRevisionDate: 17.12.2018
C3 = CC1206_1UF_100V_10%_X7R: Non-polarised capacitor; Part Description: SMD Multilayer Chip Ceramic Capacitor; Manufacturer: GENERIC; Manufacturer1 Part Number: C1206C105K1RAC; Voltage: 100V; TC: X7R; Tolerance: ±10%; Part Number: CC1206_1UF_100V_10%_X7R; Component Kind: Standard; Component Type: Standard; Pin Count: 2; Value: 1uF; Status: Preferred; Manufacturer Part Number: CC1206_1UF_100V_10%_X7R; Case: 1206; Mounted: Yes; Socket: No; SMD: Yes; Sense: No; Manufacturer1 Example: KEMET; Manufacturer1 ComponentHeight: 1.8mm; HelpURL: \\cern.ch\dfs\Applications\Altium\Datasheets\CC1206_X7R_KEMET_OPENMODE.pdf; Author: CERN DEM BC; CreateDate: 24.01.2020; LatestRevisionDate: 24.01.2020
C4 = CC0603_4.7PF_50V_0.25PF_NP0: Non-polarised capacitor; Part Description: SMD Multilayer Chip Ceramic Capacitor; Manufacturer: GENERIC; Manufacturer1 Part Number: 223886715478; Voltage: 50V; TC: C0G/NP0; Tolerance: ±0.25pF; Part Number: CC0603_4.7PF_50V_0.25PF_NP0; Component Kind: Standard; Component Type: Standard; Pin Count: 2; Value: 4.7pF; Status: Preferred; Manufacturer Part Number: CC0603_4.7PF_50V_0.25PF_NP0; Case: 0603; Mounted: Yes; Socket: No; SMD: Yes; Sense: No; Manufacturer1 Example: PHYCOMP; Manufacturer1 ComponentHeight: 0.87mm; HelpURL: \\cern.ch\dfs\Applications\Altium\Datasheets\CC0603_NP0_PHYCOMP.pdf; Author: CERN DEM JLC; CreateDate: 03.12.2007; LatestRevisionDate: 03.12.2007
C5 C6 = CC0603_4.7UF_25V_10%_X5R: Non-polarised capacitor; Part Description: SMD Multilayer Chip Ceramic Capacitor; Manufacturer: GENERIC; Manufacturer1 Part Number: GRM188R61E475KE11D; Voltage: 25V; TC: X5R; Tolerance: ±10%; Part Number: CC0603_4.7UF_25V_10%_X5R; Component Kind: Standard; Component Type: Standard; Pin Count: 2; Value: 4.7uF; Status: None; Manufacturer Part Number: CC0603_4.7UF_25V_10%_X5R; Case: 0603; Mounted: Yes; Socket: No; SMD: Yes; Sense: No; Manufacturer1 Example: MURATA; Manufacturer1 ComponentHeight: 0.95mm; HelpURL: \\cern.ch\dfs\Applications\Altium\Datasheets\CC0603_MURATA_GRM188R61E475KE11D.pdf; Author: CERN DEM JLC; CreateDate: 10.11.2014; LatestRevisionDate: 10.11.2014
C7 = CC0603_680PF_50V_5%_NP0: Non-polarised capacitor; Part Description: SMD Multilayer Chip Ceramic Capacitor; Manufacturer: GENERIC; Manufacturer1 Part Number: 223886715681; Voltage: 50V; TC: C0G/NP0; Tolerance: ±5%; Part Number: CC0603_680PF_50V_5%_NP0; Component Kind: Standard; Component Type: Standard; Pin Count: 2; Value: 680pF; Status: Preferred; Manufacturer Part Number: CC0603_680PF_50V_5%_NP0; Case: 0603; Mounted: Yes; Socket: No; SMD: Yes; Sense: No; Manufacturer1 Example: PHYCOMP; Manufacturer1 ComponentHeight: 0.87mm; HelpURL: \\cern.ch\dfs\Applications\Altium\Datasheets\CC0603_NP0_PHYCOMP.pdf; Author: CERN DEM JLC; CreateDate: 03.12.2007; LatestRevisionDate: 03.12.2007
C8 = CC0402_2.2NF_50V_10%_X7R: Non-polarised capacitor; Part Description: SMD Multilayer Chip Ceramic Capacitor; Manufacturer: GENERIC; Manufacturer1 Part Number: 223858715627; Voltage: 50V; TC: X7R; Tolerance: ±10%; Part Number: CC0402_2.2NF_50V_10%_X7R; Component Kind: Standard; Component Type: Standard; Pin Count: 2; Value: 2.2nF; Status: Not Recommended; Manufacturer Part Number: CC0402_2.2NF_50V_10%_X7R; Case: 0402; Mounted: Yes; Socket: No; SMD: Yes; Sense: No; Manufacturer1 Example: PHYCOMP; Manufacturer1 ComponentHeight: 0.55mm; HelpURL: \\cern.ch\dfs\Applications\Altium\Datasheets\CC0402_X7R_PHYCOMP.pdf; Author: CERN DEM JLC; CreateDate: 03.12.2007; LatestRevisionDate: 03.12.2007
C9 C86 = CC0603_1UF_16V_10%_X7R: Non-polarised capacitor; Part Description: SMD Multilayer Chip Ceramic Capacitor; Manufacturer: GENERIC; Manufacturer1 Part Number: 223878615663; Voltage: 16V; TC: X7R; Tolerance: ±10%; Part Number: CC0603_1UF_16V_10%_X7R; Component Kind: Standard; Component Type: Standard; Pin Count: 2; Value: 1uF; Status: None; Manufacturer Part Number: CC0603_1uF_16V_10%_X7R; Case: 0603; Mounted: Yes; Socket: No; SMD: Yes; Sense: No; Manufacturer1 Example: YAGEO PHYCOMP; Manufacturer1 ComponentHeight: 0.9mm; HelpURL: \\cern.ch\dfs\Applications\Altium\Datasheets\CC0603_X7R_PHYCOMP.pdf; Author: CERN DEM JLC; CreateDate: 03.12.2007; LatestRevisionDate: 17.04.2015
C10-C14 C17 C64 C65 C69 C70 C87 = CC0603_100NF_50V_10%_X5R: as C52 on sheet AuxPowerSupply; Part Number: CC0603_100NF_50V_10%_X5R; Component Kind: Standard; Component Type: Standard; Pin Count: 2; Value: 100nF; Status: None; Manufacturer Part Number: CC0603_100NF_50V_10%_X5R; Case: 0603; Mounted: Yes; Socket: No; SMD: Yes; Sense: No; Manufacturer1 Example: TDK; Manufacturer1 ComponentHeight: 0.9mm; HelpURL: \\cern.ch\dfs\Applications\Altium\Datasheets\CC0603_X5R_TDK_C.pdf; Author: CERN DEM MR; CreateDate: 08.01.2016; LatestRevisionDate: 08.01.2016
C15 = CAE660-540_33UF_35V_20%: Polarised capacitor; Part Description: Aluminum Electrolytic SMT Capacitor; Manufacturer: PANASONIC; Manufacturer Part Number: EEEFK1V330AP; Voltage: 35V; Tolerance: ±20%; Part Number: CAE660-540_33UF_35V_20%; Component Kind: Standard; Component Type: Standard; Pin Count: 2; Value: 33uF; Status: Not Recommended; Case: D; Mounted: Yes; Socket: No; SMD: Yes; Sense: No; ComponentHeight: 5.8mm; HelpURL: \\cern.ch\dfs\Applications\Altium\Datasheets\CAE_PANASONIC_FK-V.pdf; Author: CERN DEM JLC; CreateDate: 03.12.2007; LatestRevisionDate: 05.11.2014
C78 C79 = CC0603_100NF_50V_10%_X7R: Non-polarised capacitor; Part Description: SMD Multilayer Chip Ceramic Capacitor; Manufacturer: GENERIC; Manufacturer1 Part Number: 223858615649; Voltage: 50V; TC: X7R; Tolerance: ±10%; Part Number: CC0603_100NF_50V_10%_X7R; Component Kind: Standard; Component Type: Standard; Pin Count: 2; Value: 100nF; Status: Preferred; Manufacturer Part Number: CC0603_100NF_50V_10%_X7R; Case: 0603; Mounted: Yes; Socket: No; SMD: Yes; Sense: No; Manufacturer1 Example: PHYCOMP; Manufacturer1 ComponentHeight: 0.87mm; HelpURL: \\cern.ch\dfs\Applications\Altium\Datasheets\CC0603_X7R_PHYCOMP.pdf; Author: CERN DEM JLC; CreateDate: 03.12.2007; LatestRevisionDate: 03.12.2007
C81 C89 = CC0603_10NF_50V_10%_X7R: Non-polarised capacitor; Part Description: SMD Multilayer Chip Ceramic Capacitor; Manufacturer: GENERIC; Manufacturer1 Part Number: 223858615636; Voltage: 50V; TC: X7R; Tolerance: ±10%; Part Number: CC0603_10NF_50V_10%_X7R; Component Kind: Standard; Component Type: Standard; Pin Count: 2; Value: 10nF; Status: Preferred; Manufacturer Part Number: CC0603_10NF_50V_10%_X7R; Case: 0603; Mounted: Yes; Socket: No; SMD: Yes; Sense: No; Manufacturer1 Example: PHYCOMP; Manufacturer1 ComponentHeight: 0.87mm; HelpURL: \\cern.ch\dfs\Applications\Altium\Datasheets\CC0603_X7R_PHYCOMP.pdf; Author: CERN DEM JLC; CreateDate: 03.12.2007; LatestRevisionDate: 03.12.2007
D1 = PMEG6020ER: Schottky Diode; Part Description: MEGA Schottky Barrier Rectifier; Manufacturer: NXP SEMICONDUCTORS; Voltage: 60V; Power: 2A; PressFit: No; Bonding: No; Part Number: PMEG6020ER; Component Kind: Standard; Component Type: Standard; Device: PMEG6020ER; PackageDescription: SODFL Diode (SOD123W); 2.60mm W X 1.70mm L X 1.10mm H body, IPC Medium Density; Manufacturer Part Number: PMEG6020ER; Pin Count: 2; Case: SOD-123FL; Mounted: Yes; Socket: No; SMD: Yes; Sense: No; ComponentHeight: 1.1mm; HelpURL: \\cern.ch\dfs\Applications\Altium\Datasheets\PMEG6020ER.pdf; Author: CERN DEM JMW; CreateDate: 19.06.2014; LatestRevisionDate: 19.06.2014
IC1 = LT3090HMSE#PBF: –36V, 600mA Negative Linear Regulator with Programmable Current Limit; Part Description: -36V, 600mA Negative Linear Regulator with Programmable Current Limit; Manufacturer: LINEAR TECHNOLOGY; PressFit: No; Bonding: No; Part Number: LT3090HMSE#PBF; Component Kind: Standard; Component Type: Standard; Device: LT3090HMSE; PackageDescription: SOP, 0.65mm Pitch; 12 Pin, 3.00mm W X 4.039mm L X 1.10mm H body (w/Thermal Tab 1.75 X 2.94 mm), IPC Medium Density; Manufacturer Part Number: LT3090HMSE; Pin Count: 13; Case: MSOP12; Mounted: Yes; Socket: No; SMD: Yes; Sense: No; ComponentHeight: 1.1mm; HelpURL: \\cern.ch\dfs\Applications\Altium\Datasheets\LT3090HMSE#PBF.pdf; Author: CERN DEM JLC; CreateDate: 12.01.2015; LatestRevisionDate: 02.06.2022
IC10 = LMV321ILT: Operational Amplifier; Part Description: Low Cost, Low Power, Input/Output Rail-To-Rail Operational Amplifiers; Manufacturer: ST MICROELECTRONICS; PressFit: No; Bonding: No; Part Number: LMV321ILT; Component Kind: Standard; Component Type: Standard; Device: LMV321ILT; PackageDescription: SOT, 0.95mm pitch; 5 pin, 1.60mm W X 2.90mm L X 1.45mm H body, IPC Medium Density; Manufacturer Part Number: LMV321ILT; Pin Count: 5; Case: SOT23-5; Mounted: Yes; Socket: No; SMD: Yes; Sense: No; ComponentHeight: 1.45mm; Author: CERN DEM MR; HelpURL: \\cern.ch\dfs\Applications\Altium\Datasheets\LMV321ILT.pdf; CreateDate: 02.10.2017; LatestRevisionDate: 02.10.2017
IC12 IC13 = CD4069UBM: Hex Inverter; Part Description: CMOS Hex Inverter; Manufacturer: TEXAS INSTRUMENTS; PressFit: No; Bonding: No; Part Number: CD4069UBM; Component Kind: Standard; Component Type: Standard; Device: CD4069UBM; PackageDescription: SOIC 14, Pitch 1.27mm - Body 4x8.75mm, IPC Medium Density; Manufacturer Part Number: CD4069UBM; Pin Count: 14; Case: SOIC14; Mounted: Yes; Socket: No; SMD: Yes; Sense: No; ComponentHeight: 1.75mm; Author: CERN DEM JMW; HelpURL: \\cern.ch\dfs\Applications\Altium\Datasheets\CD4069UBM.pdf; CreateDate: 20.12.2010; LatestRevisionDate: 20.12.2010
L1 = 744871004: WE-DD SMT Shielded Coupled Inductor, size 1260, 4.7uH, 3A; Manufacturer: Wurth Elektronik; Rated Voltage: 80V; DC Resistance max.: 28mOhm; Self Resonant Frequency: 20MHz; DC Resistance typ.: 23mOhm; Saturation Current: 8A; Turns Ratio: 1:1; Type: Crossed; ComponentLink1Description: Manufacturer; ComponentLink1URL: http://www.we-online.de; ComponentLink2Description: Datasheet; ComponentLink2URL: https://www.we-online.com/catalog/datasheet/744871004.pdf; Packaging: Tape and Reel; Published Date: April 2020; Rated Current: 3A; Operating Temperature: -40 to +125degC; Size: 1260; Inductance: 4.7uH; Mounting Technology: SMT; Manufacturer Part Number: 744871004
L2 L10 = IND0805_WURTH_742792040: Part Description: SMD EMI Suppression Chip Ferrite Bead (WE-CBF Series); Manufacturer: WURTH ELEKTRONIK; Power: 2A; Resistance: 0.150R; Tolerance: ±25%; Part Number: IND0805_WURTH_742792040; Component Kind: Standard; Component Type: Standard; Pin Count: 2; Value: 600R@100MHz; Manufacturer Part Number: 742792040; Case: 0805; Mounted: Yes; Socket: No; SMD: Yes; Sense: No; ComponentHeight: 1.1mm; HelpURL: \\cern.ch\dfs\Applications\Altium\Datasheets\IND0805_WURTH_742792040.pdf; Author: CERN DEM JLC; CreateDate: 10.05.2010; LatestRevisionDate: 25.10.2018
L3 = 74479876147: WE-PMI Power Multilayer Inductor, size 0806, 0.47uH, 2.1A; Manufacturer: Wurth Elektronik; Q-Factor: 13; Saturation Current: 2A; DC Resistance max.: 50mOhm; Inductance Tolerance: +/-20%; Rated Current @20K: 1.5A; Self Resonant Frequency: 120MHz; Type: Low RDC & High Saturation Current; ComponentLink1Description: Manufacturer; ComponentLink1URL: http://www.we-online.de; ComponentLink2Description: Datasheet; ComponentLink2URL: https://www.we-online.com/catalog/datasheet/74479876147.pdf; Mounting Technology: SMT; Operating Temperature: -40 to +125degC; Packaging: Tape and Reel; Inductance: 0.47uH; Rated Current @40K: 2.1A; Manufacturer Part Number: 74479876147; Published Date: April 2020; Size: 0806
L16 = IND_10UH_20%_BOURNS_PM43: Inductor With Core; Part Description: SMD Power Inductor; Manufacturer: BOURNS; Manufacturer Part Number: PM43-100M-RC; Power: 1.15A; Resistance: 0.18R; Tolerance: ±20%; Part Number: IND_10UH_20%_BOURNS_PM43; Component Kind: Standard; Component Type: Standard; Pin Count: 2; Value: 10uH; Mounted: Yes; Socket: No; SMD: Yes; Sense: No; ComponentHeight: 3.5mm; HelpURL: \\cern.ch\dfs\Applications\Altium\Datasheets\IND_BOURNS_PM43.pdf; Author: CERN DEM JLC; CreateDate: 17.05.2011; LatestRevisionDate: 17.05.2011
P1 = CMP-009-04017-1: Trimmer, Cermet, 1W, 500000ohm, 400V, 10% +/-Tol, 100ppm/Cel, 22 Turn(s); Mounting Technology: Through Hole; Max Operating Temperature: 150°C; RoHS Compliant: Yes; Min Operating Temperature: -55°C; Power: 1W; Pins: 3; Tolerance: 10%
R2 R3 R11 R115 = R0603_100K_1%_0.1W_100PPM: Resistor - 1%; Part Description: General Purpose Thick Film Chip Resistor; Manufacturer: GENERIC; Manufacturer1 Part Number: NRC06F1003TRF; Power: 0.1W; TC: ±100ppm/°C; PressFit: No; Part Number: R0603_100K_1%_0.1W_100PPM; Component Kind: Standard; Component Type: Standard; Pin Count: 2; Value: 100k; Status: Preferred; Tolerance: ±1%; Manufacturer Part Number: R0603_100K_1%_0.1W_100PPM; Case: 0603; Mounted: Yes; Sense: No; Socket: No; SMD: Yes; Manufacturer1 Example: NIC COMPONENT; Manufacturer1 ComponentHeight: 0.55mm; HelpURL: \\cern.ch\dfs\Applications\Altium\Datasheets\R0603_NIC_NRC.pdf; Author: CERN DEM JLC; CreateDate: 03.12.2007; LatestRevisionDate: 13.03.2008
R4 = R0603_16K5_0.1%_0.063W_10PPM: Resistor - 0.1%; Part Description: Thin Film Chip Resistor; Manufacturer: GENERIC; Manufacturer1 Part Number: RN73C1J16K5BTDF; Power: 0.063W; TC: ±10ppm; PressFit: No; Part Number: R0603_16K5_0.1%_0.063W_10PPM; Component Kind: Standard; Component Type: Standard; Pin Count: 2; Value: 16k5; Status: Not Recommended; Manufacturer Part Number: R0603_16K5_0.1%_0.063W_10PPM; Case: 0603; Mounted: Yes; Sense: No; Socket: No; SMD: Yes; Manufacturer1 Example: TYCO HOLSWORTHY; Manufacturer1 ComponentHeight: 0.5mm; HelpURL: \\cern.ch\dfs\Applications\Altium\Datasheets\R0603_Tyco_RN73.pdf; Author: CERN DEM JLC; CreateDate: 03.12.2007; LatestRevisionDate: 13.03.2008
R5 = R0603_36K5_0.1%_0.063W_10PPM: Resistor - 0.1%; Part Description: Thin Film Chip Resistor; Manufacturer: GENERIC; Manufacturer1 Part Number: RN73C1J36K5BTDF; Power: 0.063W; TC: ±10ppm; PressFit: No; Part Number: R0603_36K5_0.1%_0.063W_10PPM; Component Kind: Standard; Component Type: Standard; Pin Count: 2; Value: 36k5; Status: Not Recommended; Tolerance: ±0.1%; Manufacturer Part Number: R0603_36K5_0.1%_0.063W_10PPM; Case: 0603; Mounted: Yes; Sense: No; Socket: No; SMD: Yes; Manufacturer1 Example: TYCO HOLSWORTHY; Manufacturer1 ComponentHeight: 0.5mm; HelpURL: \\cern.ch\dfs\Applications\Altium\Datasheets\R0603_Tyco_RN73.pdf; Author: CERN DEM JLC; CreateDate: 03.12.2007; LatestRevisionDate: 13.03.2008
R6 R9 R68 = R0805_180K_1%_0.125W_100PPM: Resistor - 1%; Part Description: General Purpose Thick Film Chip Resistor; Manufacturer: GENERIC; Manufacturer1 Part Number: NRC10F1803TRF; Power: 0.125W; TC: ±100ppm/°C; PressFit: No; Part Number: R0805_180K_1%_0.125W_100PPM; Component Kind: Standard; Component Type: Standard; Pin Count: 2; Value: 180k; Status: Preferred; Tolerance: ±1%; Manufacturer Part Number: R0805_180K_1%_0.125W_100PPM; Case: 0805; Mounted: Yes; Sense: No; Socket: No; SMD: Yes; Manufacturer1 Example: NIC COMPONENT; Manufacturer1 ComponentHeight: 0.6mm; HelpURL: \\cern.ch\dfs\Applications\Altium\Datasheets\R0805_NIC_NRC.pdf; Author: CERN DEM JLC; CreateDate: 03.12.2007; LatestRevisionDate: 13.03.2008
R7 = R0805_300K_1%_0.125W_100PPM: Resistor - 1%; Part Description: General Purpose Thick Film Chip Resistor; Manufacturer: GENERIC; Manufacturer1 Part Number: NRC10F3003TRF; Power: 0.125W; TC: ±100ppm/°C; PressFit: No; Part Number: R0805_300K_1%_0.125W_100PPM; Component Kind: Standard; Component Type: Standard; Pin Count: 2; Value: 300k; Status: Preferred; Tolerance: ±1%; Manufacturer Part Number: R0805_300K_1%_0.125W_100PPM; Case: 0805; Mounted: Yes; Sense: No; Socket: No; SMD: Yes; Manufacturer1 Example: NIC COMPONENT; Manufacturer1 ComponentHeight: 0.6mm; HelpURL: \\cern.ch\dfs\Applications\Altium\Datasheets\R0805_NIC_NRC.pdf; Author: CERN DEM JLC; CreateDate: 03.12.2007; LatestRevisionDate: 13.03.2008
R8 = R0805_240K_0.1%_0.1W_10PPM: Resistor - 0.1%; Part Description: Thin Film Chip Resistor; Manufacturer: GENERIC; Manufacturer1 Part Number: RN73C2A240KBTG; Power: 0.1W; TC: ±10ppm; PressFit: No; Part Number: R0805_240K_0.1%_0.1W_10PPM; Component Kind: Standard; Component Type: Standard; Pin Count: 2; Value: 240k; Status: Not Recommended; Tolerance: ±0.1%; Manufacturer Part Number: R0805_240K_0.1%_0.1W_10PPM; Case: 0805; Mounted: Yes; Sense: No; Socket: No; SMD: Yes; Manufacturer1 Example: TYCO HOLSWORTHY; Manufacturer1 ComponentHeight: 0.6mm; HelpURL: \\cern.ch\dfs\Applications\Altium\Datasheets\R0805_Tyco_RN73.pdf; Author: CERN DEM JLC; CreateDate: 23.02.2015; LatestRevisionDate: 23.02.2015
R10 = R0805_100K_0.1%_0.1W_10PPM: Resistor - 0.1%; Part Description: Thin Film Chip Resistor; Manufacturer: GENERIC; Manufacturer1 Part Number: RN73C2A100KBTG; Power: 0.1W; TC: ±10ppm; PressFit: No; Part Number: R0805_100K_0.1%_0.1W_10PPM; Component Kind: Standard; Component Type: Standard; Pin Count: 2; Value: 100k; Status: Not Recommended; Tolerance: ±0.1%; Manufacturer Part Number: R0805_100K_0.1%_0.1W_10PPM; Case: 0805; Mounted: Yes; Sense: No; Socket: No; SMD: Yes; Manufacturer1 Example: TYCO HOLSWORTHY; Manufacturer1 ComponentHeight: 0.6mm; HelpURL: \\cern.ch\dfs\Applications\Altium\Datasheets\R0805_Tyco_RN73.pdf; Author: CERN DEM JLC; CreateDate: 03.12.2007; LatestRevisionDate: 13.03.2008
R12 = R0603_20K_1%_0.1W_100PPM: Resistor - 1%; Part Description: General Purpose Thick Film Chip Resistor; Manufacturer: GENERIC; Manufacturer1 Part Number: NRC06F2002TRF; Power: 0.1W; TC: ±100ppm/°C; PressFit: No; Part Number: R0603_20K_1%_0.1W_100PPM; Component Kind: Standard; Component Type: Standard; Pin Count: 2; Value: 20k; Status: Preferred; Tolerance: ±1%; Manufacturer Part Number: R0603_20K_1%_0.1W_100PPM; Case: 0603; Mounted: Yes; Sense: No; Socket: No; SMD: Yes; Manufacturer1 Example: NIC COMPONENT; Manufacturer1 ComponentHeight: 0.55mm; HelpURL: \\cern.ch\dfs\Applications\Altium\Datasheets\R0603_NIC_NRC.pdf; Author: CERN DEM JLC; CreateDate: 03.12.2007; LatestRevisionDate: 13.03.2008
R28 = R0805_750K_1%_0.125W_100PPM: Resistor - 1%; Part Description: General Purpose Thick Film Chip Resistor; Manufacturer: GENERIC; Manufacturer1 Part Number: NRC10F7503TRF; Power: 0.125W; TC: ±100ppm/°C; PressFit: No; Part Number: R0805_750K_1%_0.125W_100PPM; Component Kind: Standard; Component Type: Standard; Pin Count: 2; Value: 750k; Status: Preferred; Manufacturer Part Number: R0805_750K_1%_0.125W_100PPM; Case: 0805; Mounted: Yes; Sense: No; Socket: No; SMD: Yes; Manufacturer1 Example: NIC COMPONENT; Manufacturer1 ComponentHeight: 0.6mm; HelpURL: \\cern.ch\dfs\Applications\Altium\Datasheets\R0805_NIC_NRC.pdf; Author: CERN DEM JLC; CreateDate: 03.12.2007; LatestRevisionDate: 13.03.2008
R40-R42 = R0603_22K_1%_0.1W_100PPM: Resistor - 1%; Part Description: General Purpose Thick Film Chip Resistor; Manufacturer: GENERIC; Manufacturer1 Part Number: NRC06F2202TRF; Power: 0.1W; TC: ±100ppm/°C; PressFit: No; Part Number: R0603_22K_1%_0.1W_100PPM; Component Kind: Standard; Component Type: Standard; Pin Count: 2; Value: 22k; Status: Preferred; Tolerance: ±1%; Manufacturer Part Number: R0603_22K_1%_0.1W_100PPM; Case: 0603; Mounted: Yes; Sense: No; Socket: No; SMD: Yes; Manufacturer1 Example: NIC COMPONENT; Manufacturer1 ComponentHeight: 0.55mm; HelpURL: \\cern.ch\dfs\Applications\Altium\Datasheets\R0603_NIC_NRC.pdf; Author: CERN DEM JLC; CreateDate: 03.12.2007; LatestRevisionDate: 13.03.2008
R43 = R0603_3K3_1%_0.1W_100PPM: Resistor - 1%; Part Description: General Purpose Thick Film Chip Resistor; Manufacturer: GENERIC; Manufacturer1 Part Number: NRC06F3301TRF; Power: 0.1W; TC: ±100ppm/°C; PressFit: No; Part Number: R0603_3K3_1%_0.1W_100PPM; Component Kind: Standard; Component Type: Standard; Pin Count: 2; Value: 3k3; Status: Preferred; Tolerance: ±1%; Manufacturer Part Number: R0603_3K3_1%_0.1W_100PPM; Case: 0603; Mounted: Yes; Sense: No; Socket: No; SMD: Yes; Manufacturer1 Example: NIC COMPONENT; Manufacturer1 ComponentHeight: 0.55mm; HelpURL: \\cern.ch\dfs\Applications\Altium\Datasheets\R0603_NIC_NRC.pdf; Author: CERN DEM JLC; CreateDate: 03.12.2007; LatestRevisionDate: 13.03.2008
R52 R57 R94 R98 R111 = R0603_10K_1%_0.1W_100PPM: as R19 on sheet AuxPowerSupply; Part Number: R0603_10K_1%_0.1W_100PPM; Component Kind: Standard; Component Type: Standard; Pin Count: 2; Value: 10k; Status: Preferred; Tolerance: ±1%; Manufacturer Part Number: R0603_10K_1%_0.1W_100PPM; Case: 0603; Mounted: Yes; Sense: No; Socket: No; SMD: Yes; Manufacturer1 Example: NIC COMPONENT; Manufacturer1 ComponentHeight: 0.55mm; HelpURL: \\cern.ch\dfs\Applications\Altium\Datasheets\R0603_NIC_NRC.pdf; Author: CERN DEM JLC; CreateDate: 03.12.2007; LatestRevisionDate: 13.03.2008
R53 = R0805_120K_0.1%_0.125W_25PPM: Resistor - 0.1%; Part Description: Thin Film Chip Resistor; Manufacturer: GENERIC; Manufacturer1 Part Number: ERA6AEB124V; Power: 0.125W; TC: ±25ppm; PressFit: No; Part Number: R0805_120K_0.1%_0.125W_25PPM; Component Kind: Standard; Component Type: Standard; Pin Count: 2; Value: 120k; Status: Not Recommended; Tolerance: ±0.1%; Manufacturer Part Number: R0805_120K_0.1%_0.125W_25PPM; Case: 0805; Mounted: Yes; Sense: No; Socket: No; SMD: Yes; Manufacturer1 Example: PANASONIC; Manufacturer1 ComponentHeight: 0.6mm; HelpURL: \\cern.ch\dfs\Applications\Altium\Datasheets\R0805_PANASONIC_ERA.pdf; Author: CERN DEM JLC; CreateDate: 04.06.2015; LatestRevisionDate: 04.06.2015
R58 R95 = R0805_66K5_0.1%_0.1W_10PPM: Resistor - 0.1%; Part Description: Thin Film Chip Resistor; Manufacturer: GENERIC; Manufacturer1 Part Number: RN73C2A66K5BTG; Power: 0.1W; TC: ±10ppm; PressFit: No; Part Number: R0805_66K5_0.1%_0.1W_10PPM; Component Kind: Standard; Component Type: Standard; Pin Count: 2; Value: 66k5; Status: Not Recommended; Tolerance: ±0.1%; Manufacturer Part Number: R0805_66K5_0.1%_0.1W_10PPM; Case: 0805; Mounted: Yes; Sense: No; Socket: No; SMD: Yes; Manufacturer1 Example: TYCO HOLSWORTHY; Manufacturer1 ComponentHeight: 0.6mm; HelpURL: \\cern.ch\dfs\Applications\Altium\Datasheets\R0805_Tyco_RN73.pdf; Author: CERN DEM JLC; CreateDate: 03.12.2007; LatestRevisionDate: 13.03.2008
R93 = R0603_18K_1%_0.1W_100PPM: Resistor - 1%; Part Description: General Purpose Thick Film Chip Resistor; Manufacturer: GENERIC; Manufacturer1 Part Number: NRC06F1802TRF; Power: 0.1W; TC: ±100ppm/°C; PressFit: No; Part Number: R0603_18K_1%_0.1W_100PPM; Component Kind: Standard; Component Type: Standard; Pin Count: 2; Value: 18k; Status: Preferred; Tolerance: ±1%; Manufacturer Part Number: R0603_18K_1%_0.1W_100PPM; Case: 0603; Mounted: Yes; Sense: No; Socket: No; SMD: Yes; Manufacturer1 Example: NIC COMPONENT; Manufacturer1 ComponentHeight: 0.55mm; HelpURL: \\cern.ch\dfs\Applications\Altium\Datasheets\R0603_NIC_NRC.pdf; Author: CERN DEM JLC; CreateDate: 03.12.2007; LatestRevisionDate: 13.03.2008
R97 = R0603_8K2_1%_0.1W_100PPM: Resistor - 1%; Part Description: General Purpose Thick Film Chip Resistor; Manufacturer: GENERIC; Manufacturer1 Part Number: NRC06F8201TRF; Power: 0.1W; TC: ±100ppm/°C; PressFit: No; Part Number: R0603_8K2_1%_0.1W_100PPM; Component Kind: Standard; Component Type: Standard; Pin Count: 2; Value: 8k2; Status: Preferred; Manufacturer Part Number: R0603_8K2_1%_0.1W_100PPM; Case: 0603; Mounted: Yes; Sense: No; Socket: No; SMD: Yes; Manufacturer1 Example: NIC COMPONENT; Manufacturer1 ComponentHeight: 0.55mm; HelpURL: \\cern.ch\dfs\Applications\Altium\Datasheets\R0603_NIC_NRC.pdf; Author: CERN DEM JLC; CreateDate: 03.12.2007; LatestRevisionDate: 13.03.2008
T10-T14 T18-T20 = BSS84LT1G: P-CHANNEL MOSFET WITH DIODE; Part Description: 50V, 130mA, Single P-Channel Power MOSFET; Manufacturer: ON SEMICONDUCTOR; Manufacturer Part Number: BSS84L; PressFit: No; Bonding: No; Part Number: BSS84LT1G; Component Kind: Standard; Component Type: Standard; Device: BSS84LT1G; PackageDescription: SOT23, 0.95mm Pitch; 3 Pin, 1.40mm W X 3.00mm L X 1.10mm H body, IPC Medium Density; Pin Count: 3; Case: SOT23-3; Mounted: Yes; Socket: No; SMD: Yes; Sense: No; ComponentHeight: 1.1mm; HelpURL: \\cern.ch\dfs\Applications\Altium\Datasheets\BSS84LT1G.pdf; Author: CERN DEM JLC; CreateDate: 29.03.2012; LatestRevisionDate: 25.05.2022
T15 = BC847B: NPN Transistor; Part Description: 45V 100mA NPN General-Purpose Transistor; Manufacturer: NXP SEMICONDUCTORS; PressFit: No; Bonding: No; Part Number: BC847B; Component Kind: Standard; Component Type: Standard; Device: BC847B; PackageDescription: SOT23, 0.95mm Pitch; 3 Pin, 1.30mm W X 2.90mm L X 1.10mm H body, IPC Medium Density; Manufacturer Part Number: BC847B; Pin Count: 3; Case: SOT23-3; Mounted: Yes; Socket: No; SMD: Yes; Sense: No; ComponentHeight: 1.1mm; HelpURL: \\cern.ch\dfs\Applications\Altium\Datasheets\BC847B.pdf; Author: CERN DEM JLC; CreateDate: 14.06.2011; LatestRevisionDate: 14.06.2011
U1 = CMP-0394-01248-1: Single Output High PSRR LDO, 200 mA, Adjustable -1.18 to -33 V Output, -3 to -36 V Input, with Ultra-Low Noise, 8-pin MSOP (DGN), -40 to 125 degC, Green (RoHS & no Sb/Br); Manufacturer: Texas Instruments; Accuracy(%): 1.5; SubFamily: Single Channel LDO; Iq(Typ)(mA): 0.05; Iout(Max)(A): 0.2; Vdo(Typ)(mV): 216; ComponentLink1URL: http://www.ti.com/; ComponentLink2Description: Datasheet; PackageDescription: 8-pin Plastic Small Outline, Body 3 x 3 mm, Pitch 0.65 mm; PackageVersion: 4073271/F; ComponentLink2URL: http://www.ti.com/general/docs/lit/getliterature.tsp?genericPartNumber=TPS7A3001&fileType=pdf; PartNumber: TPS7A3001DGNT; Eco-Plan: Green (RoHS & no Sb/Br); ComponentLink3Description: Package Specification; Vout Adj(Max)(V): -33; Vin(Min)(V): -3; Vout Adj(Min)(V): -1.18; Code_JEDEC: MO-187; ComponentLink1Description: Manufacturer URL; ComponentLink3URL: http://www.ti.com/litv/pdf/mpds046e; PackageReference: DGN8-1760X1425TP; Mounting Technology: Surface Mount; Vin(Max)(V): -36; DatasheetVersion: SBVS125A; Manufacturer Part Number: TPS7A3001DGNT
IC2 = LT8362IDD#TRPBF: Manufacturer Part Number: LT8362IDD#TRPBF